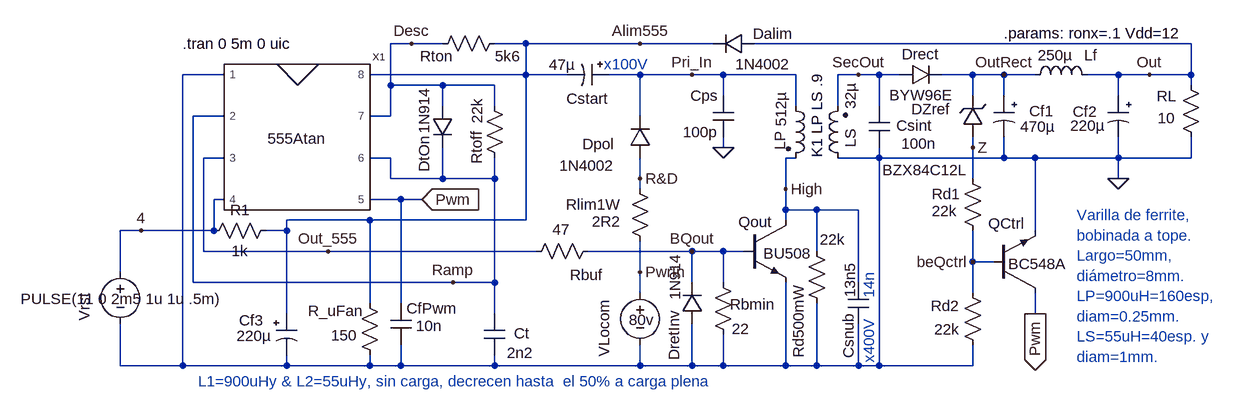
[diagram p0: schematic ResetTest.asc]
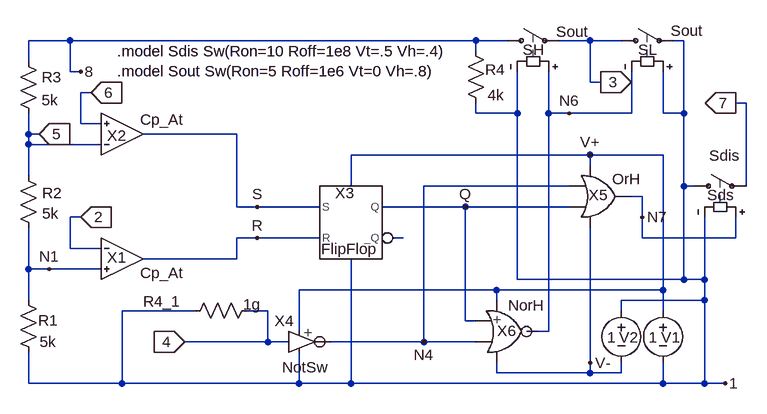
[diagram p1: sub-circuit 555atan.asc]
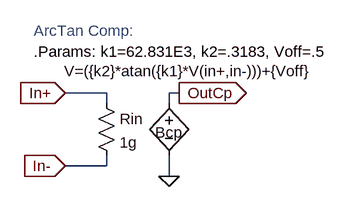
[diagram p2: sub-circuit comp_at.asc]
ResetTest.asc, the LTspice schematic file:
Version 4
SHEET 1 880 680
WIRE -1744 -256 -1776 -256
WIRE -1696 -256 -1744 -256
WIRE -1568 -256 -1616 -256
WIRE -1392 -256 -1568 -256
WIRE -1280 -256 -1392 -256
WIRE -544 -256 -1216 -256
WIRE -2032 -208 -2096 -208
WIRE -1568 -208 -1568 -256
WIRE -1568 -208 -1808 -208
WIRE -1504 -208 -1568 -208
WIRE -1392 -208 -1440 -208
WIRE -1312 -208 -1392 -208
WIRE -1264 -208 -1312 -208
WIRE -1152 -208 -1264 -208
WIRE -1056 -208 -1088 -208
WIRE -1024 -208 -1056 -208
WIRE -992 -208 -1024 -208
WIRE -880 -208 -928 -208
WIRE -832 -208 -880 -208
WIRE -784 -208 -832 -208
WIRE -656 -208 -704 -208
WIRE -608 -208 -656 -208
WIRE -544 -208 -544 -256
WIRE -544 -208 -608 -208
WIRE -1776 -192 -1776 -256
WIRE -1696 -192 -1776 -192
WIRE -1616 -192 -1696 -192
WIRE -544 -192 -544 -208
WIRE -1264 -176 -1264 -208
WIRE -880 -176 -880 -208
WIRE -832 -176 -832 -208
WIRE -656 -176 -656 -208
WIRE -1696 -160 -1696 -192
WIRE -1616 -160 -1616 -192
WIRE -1152 -160 -1152 -208
WIRE -1088 -160 -1088 -208
WIRE -1024 -160 -1024 -208
WIRE -2032 -144 -2080 -144
WIRE -1776 -144 -1776 -192
WIRE -1776 -144 -1808 -144
WIRE -1392 -144 -1392 -208
WIRE -1264 -96 -1264 -112
WIRE -880 -96 -880 -112
WIRE -2032 -80 -2064 -80
WIRE -1776 -80 -1808 -80
WIRE -1152 -80 -1168 -80
WIRE -1024 -80 -1024 -96
WIRE -1024 -80 -1088 -80
WIRE -832 -80 -832 -112
WIRE -832 -80 -1024 -80
WIRE -784 -80 -832 -80
WIRE -656 -80 -656 -112
WIRE -656 -80 -784 -80
WIRE -544 -80 -544 -112
WIRE -544 -80 -656 -80
WIRE -1776 -48 -1776 -80
WIRE -1696 -48 -1696 -96
WIRE -1696 -48 -1776 -48
WIRE -1616 -48 -1616 -80
WIRE -1616 -48 -1696 -48
WIRE -1392 -48 -1392 -80
WIRE -880 -48 -880 -96
WIRE -656 -48 -656 -80
WIRE -1392 -32 -1392 -48
WIRE -1168 -32 -1168 -80
WIRE -2032 -16 -2048 -16
WIRE -1760 -16 -1808 -16
WIRE -1728 -16 -1760 -16
WIRE -1168 0 -1168 -32
WIRE -1120 0 -1168 0
WIRE -1056 0 -1120 0
WIRE -1808 16 -1936 16
WIRE -1568 16 -1568 -208
WIRE -1568 16 -1808 16
WIRE -1168 16 -1168 0
WIRE -2160 32 -2192 32
WIRE -2048 32 -2048 -16
WIRE -2048 32 -2160 32
WIRE -1936 32 -1936 16
WIRE -1936 32 -1968 32
WIRE -784 32 -784 -80
WIRE -2064 64 -2064 -80
WIRE -1872 64 -2064 64
WIRE -1552 64 -1872 64
WIRE -1312 64 -1472 64
WIRE -1264 64 -1312 64
WIRE -1232 64 -1264 64
WIRE -1120 64 -1120 0
WIRE -880 80 -880 32
WIRE -848 80 -880 80
WIRE -2192 96 -2192 32
WIRE -1392 96 -1392 48
WIRE -2080 112 -2080 -144
WIRE -1680 112 -2080 112
WIRE -1616 112 -1616 -48
WIRE -1616 112 -1680 112
WIRE -1312 112 -1312 64
WIRE -1264 112 -1264 64
WIRE -1056 112 -1056 0
WIRE -1392 128 -1392 96
WIRE -880 128 -880 80
WIRE -1808 144 -1808 16
WIRE -1760 144 -1760 -16
WIRE -1936 160 -1936 32
WIRE -1616 160 -1616 112
WIRE -784 160 -784 128
WIRE -2192 240 -2192 176
WIRE -2096 240 -2096 -208
WIRE -2096 240 -2192 240
WIRE -1936 240 -1936 224
WIRE -1936 240 -2096 240
WIRE -1808 240 -1808 224
WIRE -1808 240 -1936 240
WIRE -1760 240 -1760 208
WIRE -1760 240 -1808 240
WIRE -1616 240 -1616 224
WIRE -1616 240 -1760 240
WIRE -1392 240 -1392 208
WIRE -1392 240 -1616 240
WIRE -1312 240 -1312 176
WIRE -1312 240 -1392 240
WIRE -1264 240 -1264 192
WIRE -1264 240 -1312 240
WIRE -1168 240 -1168 112
WIRE -1168 240 -1264 240
WIRE -1120 240 -1120 144
WIRE -1120 240 -1168 240
WIRE -1056 240 -1056 176
WIRE -1056 240 -1120 240
WIRE -1024 240 -1024 -80
WIRE -1024 240 -1056 240
WIRE -880 240 -880 208
WIRE -880 240 -1024 240
FLAG -608 -208 Out
FLAG -1872 64 Out_555
FLAG -1168 -32 High
FLAG -832 -208 OutRect
FLAG -1728 -16 Pwm
IOPIN -1728 -16 In
FLAG -880 80 beQctrl
FLAG -1392 -256 Alim555
FLAG -784 160 Pwm
IOPIN -784 160 Out
FLAG -656 -48 0
FLAG -1264 -96 0
FLAG -1312 -208 Pri_In
FLAG -1056 -208 SecOut
FLAG -1680 112 Ramp
FLAG -1312 64 BQout
FLAG -1392 96 PwrIn
FLAG -1744 -256 Desc
FLAG -1392 -48 R&D
FLAG -880 -96 Z
FLAG -2160 32 4
SYMBOL cap -1632 160 R0
WINDOW 0 70 30 Right 0
WINDOW 3 76 60 Right 0
SYMATTR InstName Ct
SYMATTR Value 2n2
SYMBOL diode -1296 176 R180
WINDOW 0 44 -56 VRight 0
WINDOW 3 42 37 VRight 0
SYMATTR InstName DretInv
SYMATTR Value 1N914
SYMBOL diode -1216 -272 R90
WINDOW 0 16 -28 VBottom 0
WINDOW 3 32 -13 VTop 0
SYMATTR InstName Dalim
SYMATTR Value 1N4002
SYMBOL diode -1376 -80 R180
WINDOW 0 55 21 Left 0
WINDOW 3 55 -12 Left 0
SYMATTR InstName Dpol
SYMATTR Value 1N4002
SYMBOL res -1600 -64 R180
WINDOW 0 28 32 VTop 0
WINDOW 3 27 88 VTop 0
SYMATTR InstName Rtoff
SYMATTR Value 22k
SYMATTR SpiceLine tol=1 pwr=0.1
SYMBOL res -1600 -272 R90
WINDOW 0 35 80 VRight 0
WINDOW 3 35 -24 VRight 0
SYMATTR InstName Rton
SYMATTR Value 5k6
SYMATTR SpiceLine tol=1 pwr=0.1
SYMBOL npn -848 128 M180
WINDOW 0 -8 107 Left 0
WINDOW 3 23 45 Left 0
SYMATTR InstName QCtrl
SYMATTR Value BC548A
SYMBOL res -864 224 R180
WINDOW 0 36 76 Left 0
WINDOW 3 36 40 Left 0
SYMATTR InstName Rd2
SYMATTR Value 22k
SYMATTR SpiceLine tol=1 pwr=0.1
SYMBOL voltage -1392 112 M0
WINDOW 0 40 70 VTop 0
WINDOW 3 -2 73 Bottom 0
WINDOW 123 41 81 Top 0
SYMATTR InstName VLocom
SYMATTR Value 80v
SYMATTR SpiceLine Rser=1m
SYMBOL res -1824 128 R0
WINDOW 0 7 28 Right 0
WINDOW 3 -3 65 Right 0
SYMATTR InstName R_uFan
SYMATTR Value 150
SYMATTR SpiceLine tol=1 pwr=0.1
SYMBOL res -1456 48 R90
WINDOW 0 52 -7 VRight 0
WINDOW 3 -18 44 VRight 0
SYMATTR InstName Rbuf
SYMATTR Value 47
SYMATTR SpiceLine tol=1 pwr=0.1
SYMBOL res -1280 96 R0
WINDOW 0 96 50 Right 0
WINDOW 3 56 87 Right 0
SYMATTR InstName Rbmin
SYMATTR Value 22
SYMATTR SpiceLine tol=1 pwr=0.1
SYMBOL polcap -816 -176 M0
WINDOW 3 -9 48 Right 0
WINDOW 0 -23 24 Right 0
SYMATTR Value 470µ
SYMATTR InstName Cf1
SYMATTR Description Capacitor
SYMATTR Type cap
SYMATTR SpiceLine V=25 Irms=470m Rser=0.16 MTBF=2000 Lser=0 mfg="Nichicon" pn="UPR1E471MPH" type="Al electrolytic" ppPkg=1
SYMBOL polcap -640 -176 M0
WINDOW 3 90 46 Right 0
WINDOW 0 86 25 Right 0
SYMATTR Value 220µ
SYMATTR InstName Cf2
SYMATTR Description Capacitor
SYMATTR Type cap
SYMATTR SpiceLine V=25 Irms=370m Rser=0.4 MTBF=5000 Lser=0 mfg="Nichicon" pn="UPG1E221MPH" type="Al electrolytic" ppPkg=1
SYMBOL ind -688 -192 M270
WINDOW 0 62 10 VBottom 0
WINDOW 3 62 65 VBottom 0
SYMATTR InstName Lf
SYMATTR Value 250µ
SYMATTR SpiceLine Ipk=3 Rser=0.2 Rpar=34000 Cpar=3p
SYMBOL polcap -1440 -224 R90
WINDOW 0 37 33 VTop 0
WINDOW 3 -15 72 VTop 0
SYMATTR InstName Cstart
SYMATTR Value 47µ
SYMATTR Description Capacitor
SYMATTR Type cap
SYMATTR SpiceLine V=100 Irms=210m Rser=0.37 MTBF=2000 Lser=0 mfg="Nichicon" pn="UPR2A470MPH" type="Al electrolytic" ppPkg=1
SYMBOL cap -1072 112 R0
WINDOW 0 1 117 VLeft 0
WINDOW 3 3 23 VLeft 0
SYMATTR InstName Csnub
SYMATTR Value 13n5
SYMBOL diode -1712 -160 R0
WINDOW 0 -12 46 VRight 0
WINDOW 3 -12 -28 VRight 0
SYMATTR InstName DtOn
SYMATTR Value 1N914
SYMBOL ind2 -1168 -176 R0
WINDOW 0 -9 55 VRight 0
WINDOW 3 -7 -6 VRight 0
SYMATTR InstName LP
SYMATTR Value 512µ
SYMATTR Type ind
SYMATTR SpiceLine Rser=1 Rpar=1430 Cpar=170p
SYMBOL ind2 -1072 -64 R180
WINDOW 0 -4 32 VRight 0
WINDOW 3 -4 91 VRight 0
SYMATTR InstName LS
SYMATTR Value 32µ
SYMATTR Type ind
SYMATTR SpiceLine Rser=0.1
SYMBOL diode -992 -192 R270
WINDOW 0 32 32 VTop 0
WINDOW 3 0 32 VBottom 0
SYMATTR InstName Drect
SYMATTR Value BYW96E
SYMBOL npn3 -1232 16 R0
WINDOW 3 30 51 Left 0
WINDOW 0 -9 3 Left 0
SYMATTR Value BU508
SYMATTR InstName Qout
SYMBOL cap -1040 -160 R0
WINDOW 0 97 30 Right 0
WINDOW 3 104 58 Right 0
SYMATTR InstName Csint
SYMATTR Value 100n
SYMBOL res -864 48 R180
WINDOW 0 79 72 Right 0
WINDOW 3 79 46 Right 0
SYMATTR InstName Rd1
SYMATTR Value 22k
SYMATTR SpiceLine tol=1 pwr=0.1
SYMBOL res -1408 -48 R0
WINDOW 0 -98 40 Left 0
WINDOW 3 -58 66 Left 0
SYMATTR InstName Rlim1W
SYMATTR Value 2R2
SYMATTR SpiceLine tol=1 pwr=0.1
SYMBOL polcap -1952 160 R0
WINDOW 3 -7 34 Right 0
WINDOW 0 -20 10 Right 0
SYMATTR Value 220µ
SYMATTR InstName Cf3
SYMATTR Description Capacitor
SYMATTR Type cap
SYMATTR SpiceLine V=16 Irms=460m Rser=0.16 MTBF=3000 Lser=0 mfg="Nichicon" pn="UPL1C221MPH" type="Al electrolytic" ppPkg=1
SYMBOL res -560 -208 R0
WINDOW 0 -37 33 Left 0
WINDOW 3 -35 67 Left 0
SYMATTR InstName RL
SYMATTR Value 10
SYMBOL cap -1776 144 R0
WINDOW 0 102 8 Right 0
WINDOW 3 80 35 Right 0
SYMATTR InstName CfPwm
SYMATTR Value 10n
SYMBOL zener -864 -112 R180
WINDOW 0 50 43 Left 0
WINDOW 3 24 -51 Left 0
SYMATTR InstName DZref
SYMATTR Value BZX84C12L
SYMBOL res -1136 48 R0
WINDOW 0 -12 66 VRight 0
WINDOW 3 21 -2 Left 0
SYMATTR InstName Rd500mW
SYMATTR Value 22k
SYMBOL cap -1248 -112 R180
WINDOW 0 24 64 Left 0
WINDOW 3 24 8 Left 0
SYMATTR InstName Cps
SYMATTR Value 100p
SYMBOL res -1952 16 R90
WINDOW 0 0 56 VBottom 0
WINDOW 3 32 56 VTop 0
SYMATTR InstName R1
SYMATTR Value 1k
SYMBOL voltage -2192 80 M0
WINDOW 0 40 70 VTop 0
WINDOW 3 -2 73 Bottom 0
WINDOW 123 41 81 Top 0
SYMATTR InstName Vrst
SYMATTR Value PULSE(11 0 2m5 1u 1u .5m)
SYMATTR SpiceLine Rser=1
SYMBOL 555Atan -1872 -96 R0
SYMATTR InstName X1
TEXT -1120 -208 VRight 0 !K1 LP LS .9
TEXT -2096 -256 Left 0 !.tran 0 5m 0 uic
TEXT -1448 -224 Left 0 ;x100V
TEXT -1040 168 VRight 0 ;x400V
TEXT -720 8 Left 0 ;Varilla de ferrite,\nbobinada a tope.\nLargo=50mm,\ndiámetro=8mm.\nLP=900uH=160esp,\ndiam=0.25mm.\nLS=55uH=40esp. y\ndiam=1mm.
TEXT -2072 264 Left 0 ;L1=900uHy & L2=55uHy, sin carga, decrecen hasta  el 50% a carga plena
TEXT -832 -272 Left 0 !.params: ronx=.1 Vdd=12
TEXT -1040 96 VRight 0 ;14n

555atan.asc, the sub-circuit schematic file:
Version 4
SHEET 1 880 780
WIRE -576 128 -576 96
WIRE -576 240 -576 208
WIRE -576 256 -576 240
WIRE -576 304 -576 256
WIRE -576 448 -576 384
WIRE -576 496 -576 448
WIRE -576 624 -576 576
WIRE -560 240 -576 240
WIRE -544 448 -576 448
WIRE -512 96 -576 96
WIRE -512 144 -512 96
WIRE -512 416 -512 368
WIRE -496 144 -512 144
WIRE -496 224 -496 176
WIRE -496 368 -512 368
WIRE -480 176 -496 176
WIRE -464 224 -496 224
WIRE -464 256 -576 256
WIRE -464 416 -512 416
WIRE -464 448 -544 448
WIRE -432 624 -576 624
WIRE -432 624 -432 512
WIRE -320 512 -432 512
WIRE -256 240 -400 240
WIRE -256 352 -256 240
WIRE -256 432 -400 432
WIRE -256 432 -256 400
WIRE -224 352 -256 352
WIRE -224 400 -256 400
WIRE -208 512 -240 512
WIRE -208 560 -336 560
WIRE -208 560 -208 512
WIRE -176 560 -208 560
WIRE -160 544 -160 480
WIRE -160 624 -432 624
WIRE -160 624 -160 576
WIRE -128 352 -224 352
WIRE -128 400 -224 400
WIRE -80 320 -80 272
WIRE -80 624 -160 624
WIRE -80 624 -80 432
WIRE 0 400 -16 400
WIRE 32 560 -112 560
WIRE 32 560 32 320
WIRE 96 352 -32 352
WIRE 96 528 96 352
WIRE 112 96 -512 96
WIRE 112 112 112 96
WIRE 112 208 112 192
WIRE 112 528 96 528
WIRE 112 560 32 560
WIRE 144 480 -160 480
WIRE 144 496 144 480
WIRE 144 608 144 592
WIRE 160 96 112 96
WIRE 176 208 112 208
WIRE 176 208 176 144
WIRE 176 464 176 208
WIRE 224 208 224 144
WIRE 224 544 208 544
WIRE 224 544 224 208
WIRE 256 208 224 208
WIRE 256 320 32 320
WIRE 256 352 96 352
WIRE 288 96 240 96
WIRE 288 160 288 96
WIRE 288 272 -80 272
WIRE 288 288 288 272
WIRE 288 592 288 384
WIRE 288 608 144 608
WIRE 288 608 288 592
WIRE 304 160 288 160
WIRE 336 96 288 96
WIRE 336 512 336 496
WIRE 336 608 288 608
WIRE 336 608 336 592
WIRE 352 208 256 208
WIRE 352 208 352 144
WIRE 368 336 352 336
WIRE 368 368 368 336
WIRE 368 400 368 368
WIRE 400 208 400 144
WIRE 400 272 288 272
WIRE 400 480 144 480
WIRE 400 480 400 272
WIRE 400 512 400 480
WIRE 400 624 -80 624
WIRE 400 624 400 592
WIRE 432 96 416 96
WIRE 432 208 400 208
WIRE 432 208 432 96
WIRE 432 320 432 208
WIRE 432 464 176 464
WIRE 432 464 432 320
WIRE 448 320 432 320
WIRE 464 464 432 464
WIRE 464 464 464 368
WIRE 464 496 336 496
WIRE 464 496 464 464
WIRE 464 624 400 624
WIRE 464 624 464 496
WIRE 496 624 464 624
WIRE 512 400 368 400
WIRE 512 400 512 368
WIRE 528 192 512 192
WIRE 528 320 528 192
FLAG -544 448 N1
FLAG -224 400 R
FLAG -496 368 2
IOPIN -496 368 In
FLAG -560 240 5
IOPIN -560 240 In
FLAG 512 192 7
IOPIN 512 192 Out
FLAG 368 368 N7
FLAG -224 352 S
FLAG 96 352 Q
FLAG -480 176 6
IOPIN -480 176 In
FLAG -496 144 8
FLAG 304 160 3
IOPIN 304 160 Out
FLAG 256 208 N6
FLAG 496 624 1
FLAG 32 560 N4
FLAG -336 560 4
IOPIN -336 560 In
FLAG 288 592 V-
FLAG 288 272 V+
SYMBOL res -592 480 R0
WINDOW 0 31 47 Left 0
WINDOW 3 33 80 Left 0
SYMATTR InstName R1
SYMATTR Value 5k
SYMBOL res -592 288 R0
WINDOW 0 37 43 Left 0
WINDOW 3 37 74 Left 0
SYMATTR InstName R2
SYMATTR Value 5k
SYMBOL res -592 112 R0
SYMATTR InstName R3
SYMATTR Value 5k
SYMBOL sw 432 320 R270
WINDOW 0 -14 36 VRight 0
WINDOW 3 47 39 VRight 0
SYMATTR InstName Sds
SYMATTR Value Sdis
SYMBOL sw 144 96 R270
WINDOW 0 -14 40 VRight 0
WINDOW 3 14 92 VRight 0
SYMATTR InstName SH
SYMATTR Value Sout
SYMBOL sw 320 96 R270
WINDOW 0 -14 42 VRight 0
WINDOW 3 15 92 VRight 0
SYMATTR InstName SL
SYMATTR Value Sout
SYMBOL res 128 208 R180
WINDOW 0 -29 67 Left 0
WINDOW 3 -28 28 Left 0
SYMATTR InstName R4
SYMATTR Value 4k
SYMBOL voltage 400 496 R0
WINDOW 0 -3 57 Left 0
WINDOW 3 -22 57 Left 0
SYMATTR InstName V1
SYMATTR Value 1
SYMBOL OrH 304 272 R0
WINDOW 3 18 37 Left 0
SYMATTR InstName X5
SYMBOL NorH 160 480 R0
WINDOW 3 2 24 Left 0
SYMATTR InstName X6
SYMBOL ff -80 304 R0
SYMATTR InstName X3
SYMBOL voltage 336 496 R0
WINDOW 0 -3 57 Left 0
WINDOW 3 -22 57 Left 0
SYMATTR InstName V2
SYMATTR Value 1
SYMBOL NotSw -176 496 R0
SYMATTR InstName X4
SYMBOL res -224 496 R90
WINDOW 0 17 147 VBottom 0
WINDOW 3 -9 8 VTop 0
SYMATTR InstName R4_1
SYMATTR Value 1g
SYMBOL Comp_At -432 368 R0
SYMATTR InstName X1
SYMBOL Comp_At -432 304 M180
SYMATTR InstName X2
TEXT -440 112 Left 0 !.model Sdis Sw(Ron=10 Roff=1e8 Vt=.5 Vh=.4)\n.model Sout Sw(Ron=5 Roff=1e6 Vt=0 Vh=.8)

comp_at.asc, the sub-circuit schematic file:
Version 4
SHEET 1 880 680
WIRE -32 192 -96 192
WIRE -32 208 -32 192
WIRE -32 304 -96 304
WIRE -32 304 -32 288
WIRE 64 208 64 192
WIRE 64 320 64 288
WIRE 80 192 64 192
FLAG -96 192 In+
IOPIN -96 192 In
FLAG -96 304 In-
IOPIN -96 304 In
FLAG 80 192 OutCp
IOPIN 80 192 Out
FLAG 64 320 0
SYMBOL bv 64 192 R0
WINDOW 0 -21 61 Left 0
WINDOW 3 -161 -34 Left 0
SYMATTR InstName Bcp
SYMATTR Value V=({k2}*atan({k1}*V(in+,in-)))+{Voff}
SYMBOL res -48 192 R0
SYMATTR InstName Rin
SYMATTR Value 1g
TEXT -144 128 Left 0 !.Params: k1=62.831E3, k2=.3183, Voff=.5
TEXT -144 96 Left 0 ;ArcTan Comp:

The netlist it stands for:
* ResetTest.asc
Ct Ramp 0 2n2
DretInv 0 BQout 1N914
Dalim Out Alim555 1N4002
Dpol R&D Pri_In 1N4002
Rtoff Ramp Desc 22k tol=1 pwr=0.1
Rton Alim555 Desc 5k6 tol=1 pwr=0.1
QCtrl Pwm beQctrl 0 0 BC548A
Rd2 0 beQctrl 22k tol=1 pwr=0.1
VLocom PwrIn 0 80v Rser=1m
R_uFan Alim555 0 150 tol=1 pwr=0.1
Rbuf BQout Out_555 47 tol=1 pwr=0.1
Rbmin BQout 0 22 tol=1 pwr=0.1
Cf1 OutRect 0 470µ V=25 Irms=470m Rser=0.16 MTBF=2000 Lser=0 mfg="Nichicon" pn="UPR1E471MPH" type="Al electrolytic" ppPkg=1
Cf2 Out 0 220µ V=25 Irms=370m Rser=0.4 MTBF=5000 Lser=0 mfg="Nichicon" pn="UPG1E221MPH" type="Al electrolytic" ppPkg=1
Lf Out OutRect 250µ Ipk=3 Rser=0.2 Rpar=34000 Cpar=3p
Cstart Pri_In Alim555 47µ V=100 Irms=210m Rser=0.37 MTBF=2000 Lser=0 mfg="Nichicon" pn="UPR2A470MPH" type="Al electrolytic" ppPkg=1
Csnub High 0 13n5
DtOn Desc Ramp 1N914
LP Pri_In High 512µ Rser=1 Rpar=1430 Cpar=170p
LS 0 SecOut 32µ Rser=0.1
Drect SecOut OutRect BYW96E
Qout High BQout 0 0 BU508
Csint SecOut 0 100n
Rd1 beQctrl Z 22k tol=1 pwr=0.1
Rlim1W R&D PwrIn 2R2 tol=1 pwr=0.1
Cf3 Alim555 0 220µ V=16 Irms=460m Rser=0.16 MTBF=3000 Lser=0 mfg="Nichicon" pn="UPL1C221MPH" type="Al electrolytic" ppPkg=1
RL Out 0 10
CfPwm Pwm 0 10n
DZref Z OutRect BZX84C12L
Rd500mW High 0 22k
Cps 0 Pri_In 100p
R1 Alim555 4 1k
Vrst 4 0 PULSE(11 0 2m5 1u 1u .5m) Rser=1
XX1 0 Ramp Out_555 4 Pwm Ramp Desc Alim555 555atan params: 555Atan

* block symbol definitions
.subckt 555atan 1 2 3 4 5 6 7 8
R1 N1 1 5k
R2 5 N1 5k
R3 8 5 5k
Sds 1 7 N7 1 Sdis
SH 8 3 N6 1 Sout
SL 3 1 1 N6 Sout
R4 1 8 4k
V1 V+ 1 1
XX5 N4 Q V+ V- N7 OrH params: OrH  ; pins A B V+ V- Y
XX6 Q N4 V+ V- N6 NorH params: NorH  ; pins A B V+ V- Y
XX3 S R V+ 1 Q N001 ff params: FlipFlop  ; pins S R V+ 1 Q _Q
V2 1 V- 1
XX4 4 V+ 1 N4 NotSw params: NotSw  ; pins in V+ 1 _Q
R4_1 4 1 1g
XX1 N1 2 R comp_at params: Cp_At
XX2 6 5 S comp_at params: Cp_At
.model Sdis Sw(Ron=10 Roff=1e8 Vt=.5 Vh=.4)
.model Sout Sw(Ron=5 Roff=1e6 Vt=0 Vh=.8)
.ends 555atan

.subckt comp_at In+ In- OutCp
Bcp OutCp 0 V=({k2}*atan({k1}*V(in+,in-)))+{Voff}
Rin In+ In- 1g
.Params: k1=62.831E3, k2=.3183, Voff=.5
* ArcTan Comp:
.ends comp_at

.model D D
.lib standard.dio
.model NPN NPN
.model PNP PNP
.lib standard.bjt
K1 LP LS .9
.tran 0 5m 0 uic
* x100V
* x400V
* Varilla de ferrite,
* bobinada a tope.
* Largo=50mm,
* diámetro=8mm.
* LP=900uH=160esp,
* diam=0.25mm.
* LS=55uH=40esp. y
* diam=1mm.
* L1=900uHy & L2=55uHy, sin carga, decrecen hasta  el 50% a carga plena
.params: ronx=.1 Vdd=12
* 14n
.backanno
.end